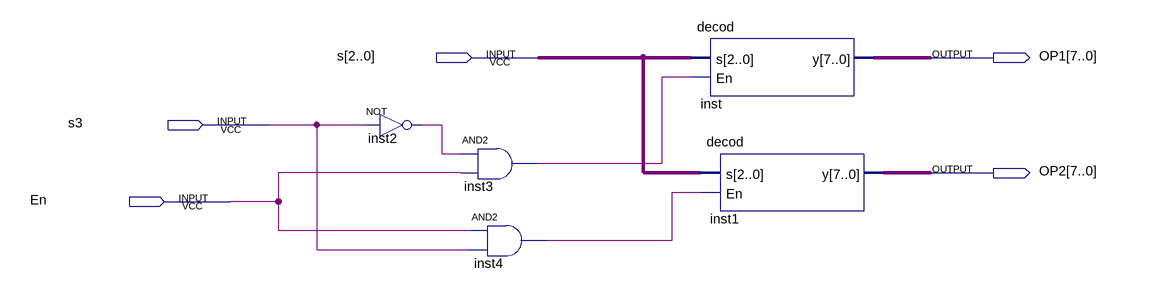
[diagram p0: schematic sheet]
// Quartus schematic 4to16decod.bdf as structural Verilog: 5 symbols, 5 pins
module \4to16decod  (
  input  [2:0] s,
  input  s3,
  input  En,
  output [7:0] OP1,
  output [7:0] OP2
);

  wire inst2_out, inst3_out, inst4_out;

  not inst2 (inst2_out, s3);
  and inst3 (inst3_out, inst2_out, En);
  and inst4 (inst4_out, En, s3);
  decod inst (.s(s), .En(inst3_out), .y(OP1));
  decod inst1 (.s(s), .En(inst4_out), .y(OP2));
endmodule
